# Altium schematic sheet CommitV2.0.SchDoc
size A4
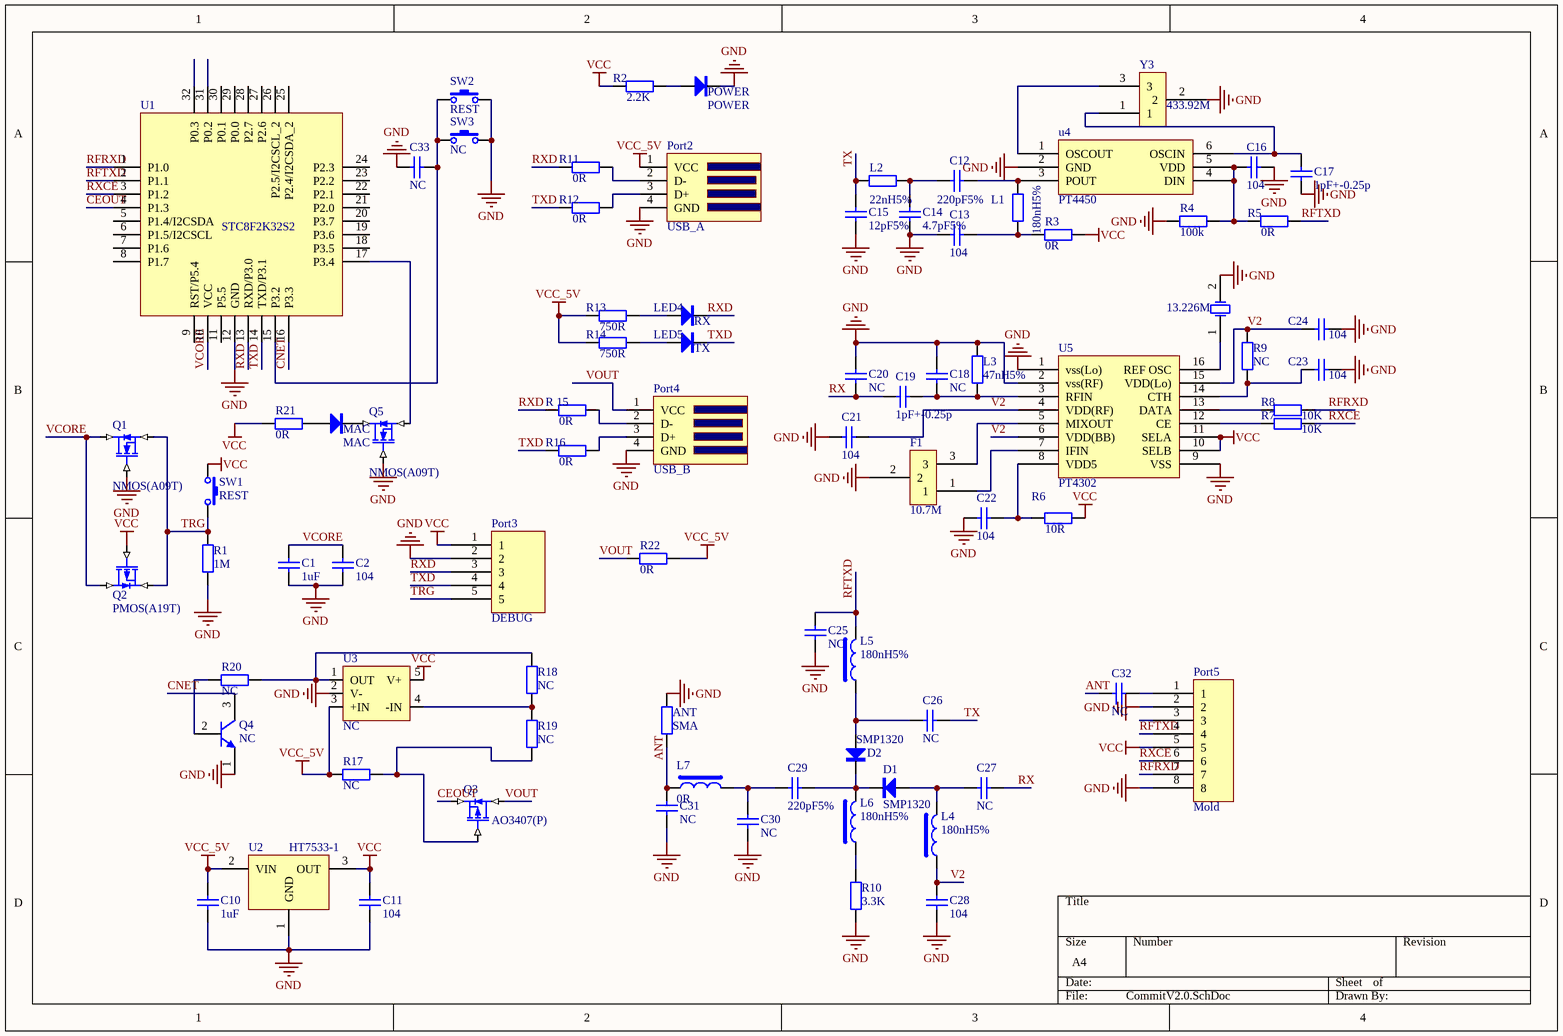
[diagram p0: CommitV2.0.SchDoc]

## Parts
ANT  SMA  [SWA-KE天线母座]
C1  1uF  [0603]
C2  104  [0603]
C10  1uF  [0603]
C11  104  [0603]
C12  220pF5%  [0603]
C13  104  [0603]
C14  4.7pF5%  [0603]
C15  12pF5%  [0603]
C16  104  [0603]
C17  1pF+-0.25p  [0603]
C18  NC  [0603]
C19  1pF+-0.25p  [0603]
C20  NC  [0603]
C21  104  [0603]
C22  104  [0603]
C23  104  [0603]
C24  104  [0603]
C25  NC  [0603]
C26  NC  [0603]
C27  NC  [0603]
C28  104  [0603]
C29  220pF5%  [0603]
C30  NC  [0603]
C31  NC  [0603]
C32  NC  [0603]
C33  NC  [0603]
D1  SMP1320  [0603]
D2  SMP1320  [0603]
F1  10.7M  [PT4450 XTAL]
L1  180nH5%  [0603]
L2  22nH5%  [0603]
L3  47nH5%  [0603]
L4  180nH5%  [0603]
L5  180nH5%  [0603]
L6  180nH5%  [0603]
L7  0R  [0603]
LED4  RX  [LED-0603]
LED5  TX  [LED-0603]
MAC  MAC  [2.54LED]
Port2  USB_A  [USB-A]
Port3  DEBUG  [STC_DEBUG]
Port4  USB_B  [USB-A]
Port5  Mold  [Pin-8]
POWER  POWER  [2.54LED]
Q1  NMOS(A09T)  [SOT-23]
Q2  PMOS(A19T)  [SOT-23]
Q3  AO3407(P)  [SOT-23]
Q4  NC  [SOT-23]
Q5  NMOS(A09T)  [SOT-23]
R1  1M  [0603]
R2  2.2K  [0603]
R3  0R  [0603]
R4  100k  [0603]
R5  0R  [0603]
R6  10R  [0603]
R7  10K  [0603]
R8  10K  [0603]
R9  NC  [0603]
R10  3.3K  [0603]
R11  0R  [0603]
R12  0R  [0603]
R13  750R  [0603]
R14  750R  [0603]
R16  0R  [0603]
R17  NC  [0603]
R18  NC  [0603]
R19  NC  [0603]
R20  NC  [0603]
R21  0R  [0603]
R22  0R  [0805]
R_15  0R  [0603]
SW1  REST  [SW-1]
SW2  REST  [Key1]
SW3  NC  [Key1]
U1  STC8F2K32S2  [LQPF-32]
U2  HT7533-1  [3A5A3D]
U3  NC  [AD8628]
u4  PT4450
U5  PT4302  [PT4302]
Y3  433.92M  [PT4450 XTAL]
Y4  13.226M  [PT4306 XTAL]

## Nets
GND: ANT.2 C1.1 C2.1 C10.2 C11.2 C13.1 C14.1 C15.1 C16.1 C17.2 C18.1 C20.2 C21.2 C22.2 C23.1 C24.1 C25.2 C28.1 C30.2 C31.2 C33.1 F1.2 L3.2 Port2.4(GND) Port3.2 Port4.4(GND) Port5.2 Port5.8 POWER.2 Q1.1(G) Q4.1(E) Q5.1(G) R1.1 R4.2 R10.2 SW2.2 SW3.2 U1.12(GND) U2.1(GND) U3.2(V-) u4.2(GND) U5.1(vss(Lo)) U5.2(vss(RF)) U5.9(VSS) Y3.2 Y4.2(OSC2)
VCC: C11.1 Port3.1 Port5.5 Q2.1(G) R2.2 R3.1 R6.1 R21.2 SW1.1 U2.3(OUT) U3.5(V+) U5.10(SELB) U5.11(SELA)
VCC_5V: C10.1 Port2.1(VCC) R13.2 R14.2 R17.2 R22.1 U2.2(VIN) U3.3(+IN)
ANT: ANT.1 C31.1 C32.1 L7.1
CEOUT: Q3.2(S) U1.4(P1.3)
CNET: Q4.3(C) U1.16(P3.3)
RFRXD: Port5.7 R8.1 U1.1(P1.0)
RFTXD: C25.1 L5.2 Port5.4 R5.1 U1.2(P1.1)
RX: C19.1 C20.1 C27.2
RXCE: Port5.6 R7.1 U1.3(P1.2)
RXD: LED4.2 Port3.3 R11.2 R_15.2 U1.13(RXD/P3.0)
TRG: Port3.5 Q1.2(D) Q2.2(S) R1.2 SW1.2
TX: C15.2 C26.2 L2.1
TXD: LED5.2 Port3.4 R12.2 R16.2 U1.14(TXD/P3.1)
V2: C21.1 C24.2 C28.2 L4.1 R9.1 U5.4(VDD(RF)) U5.6(VDD(BB)) U5.15(VDD(Lo))
VCORE: C1.2 C2.2 Q1.3(S) Q2.3(D) U1.10(VCC)
VOUT: Port4.1(VCC) Q3.3(D) R22.2
NetC12_1: C12.1 C14.2 L2.2
NetC12_2: C12.2 L1.1 u4.3(POUT)
NetC13_2: C13.2 L1.2 R3.2
NetC16_2: C16.2 R4.1 R5.2 u4.4(DIN) u4.5(VDD)
NetC17_1: C17.1 u4.6(OSCIN) Y3.1
NetC18_2: C18.2 C19.2 L3.1 U5.3(RFIN)
NetC22_1: C22.1 R6.2 U5.8(VDD5)
NetC23_2: C23.2 R9.2 U5.14(CTH)
NetC26_1: C26.1 D2.1 L5.1
NetC27_1: C27.1 D1.1 L4.2
NetC29_1: C29.1 D1.2 D2.2 L6.2
NetC29_2: C29.2 C30.1 L7.2
NetC32_2: C32.2 Port5.1
NetC33_2: C33.2 SW2.1 SW3.1 U1.15(P3.2)
NetF1_1: F1.1 U5.7(IFIN)
NetF1_3: F1.3 U5.5(MIXOUT)
NetL6_1: L6.1 R10.1
NetLED4_1: LED4.1 R13.1
NetLED5_1: LED5.1 R14.1
NetMAC_1: MAC.1 R21.1
NetMAC_2: MAC.2 Q5.3(S)
NetPort2_2: Port2.2(D-) R11.1
NetPort2_3: Port2.3(D+) R12.1
NetPort4_2: Port4.2(D-) R_15.1
NetPort4_3: Port4.3(D+) R16.1
NetPOWER_1: POWER.1 R2.1
NetQ3_1: Q3.1(G) R17.1 R19.1
NetQ4_2: Q4.2(B) R20.2
NetQ5_2: Q5.2(D) U1.17(P3.4)
NetR7_2: R7.2 U5.12(CE)
NetR8_2: R8.2 U5.13(DATA)
NetR18_1: R18.1 R19.2 U3.4(-IN)
NetR18_2: R18.2 R20.1 U3.1(OUT)
Netu4_1: u4.1(OSCOUT) Y3.3
NetU5_16: U5.16(REF_OSC) Y4.1(OSC1)

Not connected (* = marked no-connect by the designer): Port5 3; U1 5(P1.4/I2CSDA) 6(P1.5/I2CSCL) 7(P1.6) 8(P1.7) 9(RST/P5.4) 11(P5.5) 18(P3.5) 19(P3.6) 20(P3.7) 21(P2.0) 22(P2.1) 23(P2.2) 24(P2.3) 25(P2.4/I2CSDA_2) 26(P2.5/I2CSCL_2) 27(P2.6) 28(P2.7) 29(P0.0) 30(P0.1) 31(P0.2) 32(P0.3)

## Library data of the parts
ANT L1-L3 R1-R14 R16-R22 R_15 = Res2: Resistor; Published: 8-Jun-2000; LatestRevisionDate: 17-Jul-2002; LatestRevisionNote: Re-released for DXP Platform.; PackageReference: AXIAL-0.4; Publisher: Altium Limited
C1 C2 C10-C33 = Cap: Capacitor; Published: 8-Jun-2000; LatestRevisionDate: 17-Jul-2002; LatestRevisionNote: Re-released for DXP Platform.; PackageReference: RAD-0.3; Publisher: Altium Limited
D1 D2 LED4 LED5 MAC POWER = DIODE
F1 = Filter
L4-L7 = L: Inductor
Port2 Port4 = USB
Port3 = PIN-5
Port5 = Pin-8
Q1 Q5 = MOSFET-N: mosfet
Q2 Q3 = MOSFET-P: mosfet
Q4 = 2N3904: NPN General Purpose Amplifier; Published: 8-Jun-2000; LatestRevisionDate: 15-Jan-2003; LatestRevisionNote: PCB Footprint 'BCY-W3/D4.7' replaced; DatasheetDocument: 1997; PackageDocument: Sep-1998; PackageReference: TO-92A; Publisher: Altium Limited; Code_JEDEC: TO-92A; ComponentLink1Description: Manufacturer Link; ComponentLink1URL: http://www.fairchildsemi.com/; ComponentLink2Description: Datasheet; ComponentLink2URL: http://www.fairchildsemi.com/ds/2N%2F2N3904.pdf
SW1-SW3 = SW-P: key
U1 = STC8F2K64S2
U3 = AD8628
Y3 = PT4450-XTAL
Y4 = XTAL: Crystal Oscillator